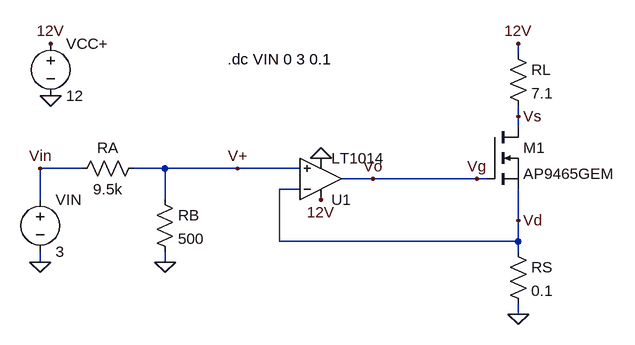
[diagram p0: schematic AmpOpDriver.asc]
AmpOpDriver.asc, the LTspice schematic file:
Version 4
SHEET 1 904 680
WIRE 608 -144 608 -160
WIRE 608 -48 608 -64
WIRE 608 -32 608 -48
WIRE -64 32 -128 32
WIRE 64 32 16 32
WIRE 176 32 64 32
WIRE 272 32 176 32
WIRE 384 48 336 48
WIRE 544 48 384 48
WIRE 560 48 544 48
WIRE 272 64 240 64
WIRE -128 80 -128 32
WIRE 64 80 64 32
WIRE 608 112 608 64
WIRE 240 144 240 64
WIRE 608 144 608 112
WIRE 608 144 240 144
WIRE 608 160 608 144
WIRE -128 176 -128 160
WIRE 64 176 64 160
WIRE 608 256 608 240
FLAG -128 176 0
FLAG 64 176 0
FLAG -112 -160 12V
FLAG 608 -160 12V
FLAG 304 80 12V
FLAG -128 32 Vin
FLAG 176 32 V+
FLAG 608 112 Vd
FLAG 608 -48 Vs
FLAG 544 48 Vg
FLAG 384 48 Vo
FLAG -112 -80 0
FLAG 608 256 0
FLAG 304 16 0
SYMBOL voltage -128 64 R0
WINDOW 123 0 0 Left 0
WINDOW 39 0 0 Left 0
SYMATTR InstName VIN
SYMATTR Value 3
SYMBOL res 32 16 R90
WINDOW 0 0 56 VBottom 2
WINDOW 3 32 56 VTop 2
SYMATTR InstName RA
SYMATTR Value 9.5k
SYMBOL res 48 64 R0
SYMATTR InstName RB
SYMATTR Value 500
SYMBOL OpAmps\\LT1014 304 112 M180
SYMATTR InstName U1
SYMBOL res 592 144 R0
SYMATTR InstName RS
SYMATTR Value 0.1
SYMBOL res 592 -160 R0
SYMATTR InstName RL
SYMATTR Value 7.1
SYMBOL voltage -112 -176 R0
WINDOW 123 0 0 Left 0
WINDOW 39 0 0 Left 0
SYMATTR InstName VCC+
SYMATTR Value 12
SYMBOL nmos 560 -32 R0
SYMATTR InstName M1
SYMATTR Value AP9465GEM
TEXT 160 -136 Left 2 !.dc VIN 0 3 0.1

The netlist it stands for:
* AmpOpDriver.asc
VIN Vin 0 3
RA V+ Vin 9.5k
RB V+ 0 500
XU1 V+ Vd 12V 0 Vo LT1014  ; pins In+ In- V+ V- OUT
RS Vd 0 0.1
RL 12V Vs 7.1
VCC+ 12V 0 12
M1 Vs Vo Vd Vd AP9465GEM
.model NMOS NMOS
.model PMOS PMOS
.lib standard.mos
.dc VIN 0 3 0.1
.backanno
.end